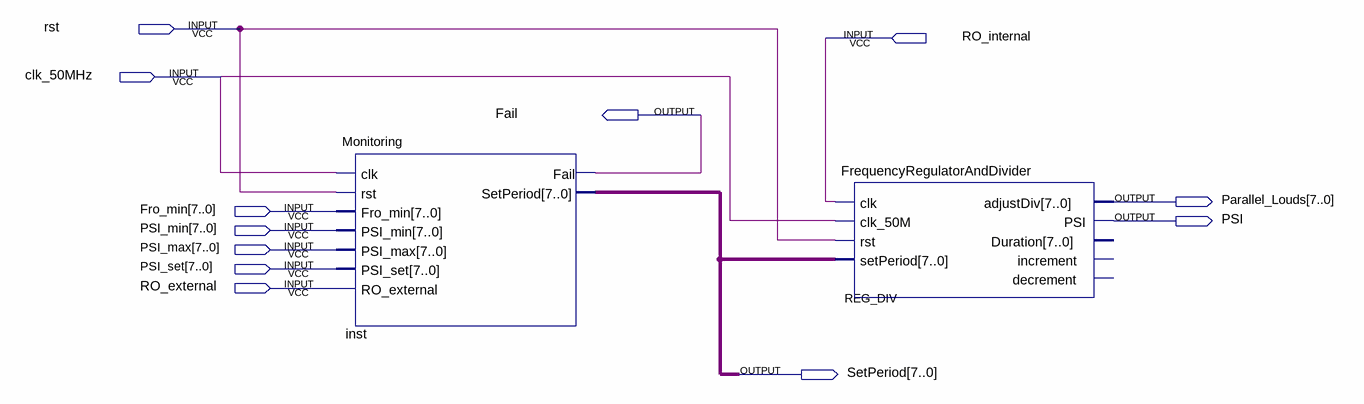
[diagram p0: schematic sheet]
// Quartus schematic Monitor_And_Regulator.bdf as structural Verilog: 2 symbols, 12 pins
module Monitor_And_Regulator (
  input  rst,
  input  RO_internal,
  input  clk_50MHz,
  input  [7:0] Fro_min,
  input  [7:0] PSI_min,
  input  [7:0] PSI_max,
  input  [7:0] PSI_set,
  input  RO_external,
  output Fail,
  output [7:0] Parallel_Louds,
  output PSI,
  output [7:0] SetPeriod
);

  Monitoring inst (
    .clk(clk_50MHz), .rst(rst), .Fro_min(Fro_min), .PSI_min(PSI_min), .PSI_max(PSI_max), .PSI_set(PSI_set),
    .RO_external(RO_external), .Fail(Fail), .SetPeriod(SetPeriod));
  FrequencyRegulatorAndDivider REG_DIV (
    .clk(RO_internal), .clk_50M(clk_50MHz), .rst(rst), .setPeriod(SetPeriod), .adjustDiv(Parallel_Louds),
    .PSI(PSI));  // open: Duration, increment, decrement
endmodule
